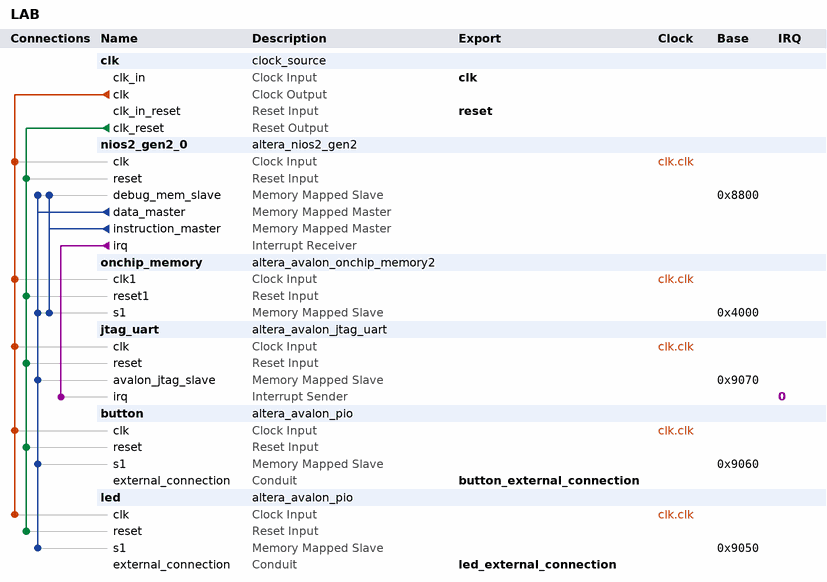
[diagram p0: system contents]
# Platform Designer (Qsys) system LAB, Cyclone IV E EP4CE6E22C6
# Parameters at their usual value, and those the tool derives, are not listed.
package require -exact qsys 20.1
create_system LAB
set_project_property DEVICE_FAMILY {Cyclone IV E}
set_project_property DEVICE EP4CE6E22C6

add_instance clk clock_source 20.1
set_instance_parameter_value clk clockFrequency 50000000

add_instance nios2_gen2_0 altera_nios2_gen2 20.1
set_instance_parameter_value nios2_gen2_0 dcache_size 2048
set_instance_parameter_value nios2_gen2_0 exceptionSlave onchip_memory.s1
set_instance_parameter_value nios2_gen2_0 icache_size 4096
set_instance_parameter_value nios2_gen2_0 impl Tiny
set_instance_parameter_value nios2_gen2_0 resetSlave onchip_memory.s1

add_instance onchip_memory altera_avalon_onchip_memory2 20.1
set_instance_parameter_value onchip_memory dataWidth 32
set_instance_parameter_value onchip_memory dualPort false
set_instance_parameter_value onchip_memory initMemContent false
set_instance_parameter_value onchip_memory initializationFileName onchip_mem.hex
set_instance_parameter_value onchip_memory memorySize 16384

add_instance jtag_uart altera_avalon_jtag_uart 20.1
set_instance_parameter_value jtag_uart simInteractiveOptions NO_INTERACTIVE_WINDOWS

add_instance button altera_avalon_pio 20.1
set_instance_parameter_value button direction Input
set_instance_parameter_value button width 2

add_instance led altera_avalon_pio 20.1
set_instance_parameter_value led direction Output
set_instance_parameter_value led width 4

# connections
add_connection clk.clk button.clk clock
add_connection clk.clk jtag_uart.clk clock
add_connection clk.clk led.clk clock
add_connection clk.clk nios2_gen2_0.clk clock
add_connection clk.clk onchip_memory.clk1 clock
add_connection clk.clk_reset button.reset reset
add_connection clk.clk_reset jtag_uart.reset reset
add_connection clk.clk_reset led.reset reset
add_connection clk.clk_reset nios2_gen2_0.reset reset
add_connection clk.clk_reset onchip_memory.reset1 reset
add_connection nios2_gen2_0.data_master button.s1 avalon
set_connection_parameter_value nios2_gen2_0.data_master/button.s1 baseAddress 0x9060
add_connection nios2_gen2_0.data_master jtag_uart.avalon_jtag_slave avalon
set_connection_parameter_value nios2_gen2_0.data_master/jtag_uart.avalon_jtag_slave baseAddress 0x9070
add_connection nios2_gen2_0.data_master led.s1 avalon
set_connection_parameter_value nios2_gen2_0.data_master/led.s1 baseAddress 0x9050
add_connection nios2_gen2_0.data_master nios2_gen2_0.debug_mem_slave avalon
set_connection_parameter_value nios2_gen2_0.data_master/nios2_gen2_0.debug_mem_slave baseAddress 0x8800
add_connection nios2_gen2_0.data_master onchip_memory.s1 avalon
set_connection_parameter_value nios2_gen2_0.data_master/onchip_memory.s1 baseAddress 0x4000
add_connection nios2_gen2_0.instruction_master nios2_gen2_0.debug_mem_slave avalon
set_connection_parameter_value nios2_gen2_0.instruction_master/nios2_gen2_0.debug_mem_slave baseAddress 0x8800
add_connection nios2_gen2_0.instruction_master onchip_memory.s1 avalon
set_connection_parameter_value nios2_gen2_0.instruction_master/onchip_memory.s1 baseAddress 0x4000
add_connection nios2_gen2_0.irq jtag_uart.irq interrupt
set_connection_parameter_value nios2_gen2_0.irq/jtag_uart.irq irqNumber 0

# exported interfaces
add_interface button_external_connection conduit end
set_interface_property button_external_connection EXPORT_OF button.external_connection
add_interface clk clock sink
set_interface_property clk EXPORT_OF clk.clk_in
add_interface led_external_connection conduit end
set_interface_property led_external_connection EXPORT_OF led.external_connection
add_interface reset reset sink
set_interface_property reset EXPORT_OF clk.clk_in_reset

set_interconnect_requirement {$system} qsys_mm.clockCrossingAdapter HANDSHAKE
set_interconnect_requirement {$system} qsys_mm.enableEccProtection FALSE
set_interconnect_requirement {$system} qsys_mm.insertDefaultSlave FALSE
set_interconnect_requirement {$system} qsys_mm.maxAdditionalLatency 1

save_system LAB.qsys
